# Altium project Autobot_project.PrjPcb
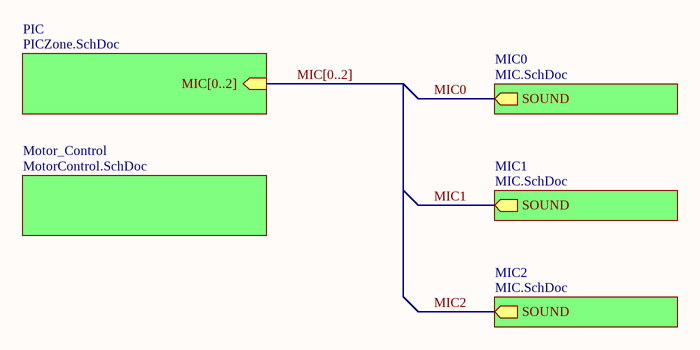
[diagram p0: MicsBus.SchDoc]
3 sheets, 47 parts. Net scope: hierarchical (ports join the sheet entries above them; power ports are global).
Board file: PCB_Autobot.PcbDoc
Sheets:
  MicsBus.SchDoc
    MIC0 = MIC.SchDoc
    MIC1 = MIC.SchDoc
    MIC2 = MIC.SchDoc
    Motor_Control = MotorControl.SchDoc

## Sheet MicsBus.SchDoc: Main
size A4; Organization: Autobot Limited; Address1: 96, boulevard Bessiere; Address4: 75017 PARIS; SheetNumber: 1

### Sub-sheets
MIC0 = MIC.SchDoc: SOUND (out)
MIC1 = MIC.SchDoc: SOUND (out)
MIC2 = MIC.SchDoc: SOUND (out)
Motor_Control = MotorControl.SchDoc: no entries
PIC = PICZone.SchDoc (file not in this document): MIC[0..2] (in)

### Buses and harness runs
bus MIC[0..2] = sheet PIC/MIC[0..2]

### Notes on the sheet
- Title
- Size:
- Date:
- A4
- Number:
- Time:
- Revision:
- Sheet
- of
- File:

## Sheet MIC.SchDoc: Mic
size A4; Organization: Autobot Limited; Address1: 96, boulevard Bessiere; Address4: 75017 PARIS; SheetNumber: 4
Used 3 times, as channels MIC0, MIC1, MIC2. Parts and nets are listed once, with the designators drawn on the sheet.
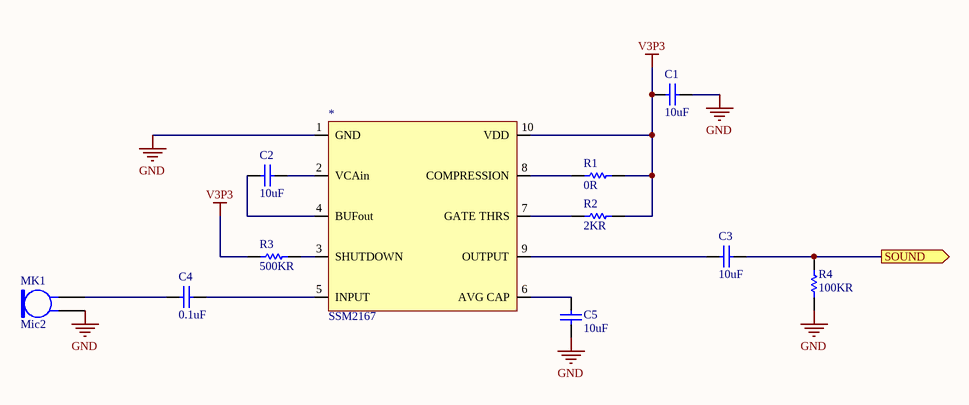
[diagram p1: MIC.SchDoc]

### Parts
*  SSM2167
C1  10uF  [RAD-0.3]
C2  10uF  [RAD-0.3]
C3  10uF  [RAD-0.3]
C4  0.1uF  [RAD-0.3]
C5  10uF  [RAD-0.3]
MK1  Mic2  [PIN2]
R1  0R  [AXIAL-0.3]
R2  2KR  [AXIAL-0.3]
R3  500KR  [AXIAL-0.3]
R4  100KR  [AXIAL-0.3]

### Ports
SOUND (out)

### Nets
GND: *.1(GND) C1.1 C5.2 MK1.1 R4.1
V3P3: *.10(VDD) C1.2 R1.1 R2.1 R3.2
SOUND: C3.1 R4.2 ; port SOUND
Net*_2: *.2(VCAin) C2.1
Net*_3: *.3(SHUTDOWN) R3.1
Net*_4: *.4(BUFout) C2.2
Net*_5: *.5(INPUT) C4.2
Net*_6: *.6(AVG_CAP) C5.1
Net*_7: *.7(GATE_THRS) R2.2
Net*_8: *.8(COMPRESSION) R1.2
Net*_9: *.9(OUTPUT) C3.2
NetC4_1: C4.1 MK1.2

### Channels
MIC0: designators end in _MIC0; ports SOUND=MIC0
MIC1: designators end in _MIC1; ports SOUND=MIC1
MIC2: designators end in _MIC2; ports SOUND=MIC2

### Notes on the sheet
- Title
- Size:
- Date:
- A4
- Number:
- Time:
- Revision:
- Sheet
- of
- File:

### Library data of the parts
* = SSM2167: Fabricant: ANALOG DEVICES; Fournisseur: Farnell; RefFabricant: SSM2167-1RMZ; RefFournisseur: 2067797
C1-C5 = Cap: Capacitor; Published: 8-Jun-2000; LatestRevisionDate: 17-Jul-2002; LatestRevisionNote: Re-released for DXP Platform.; PackageReference: RAD-0.3; Publisher: Altium Limited; PackageDescription: Radial Cap, Thru-Hole; 2 Leads; 0.3 in Pin Spacing
  C1-C3 C5: Value: 10uF
  C4: Value: 0.1uF
MK1 = Mic2: Microphone; Fabricant: PRO SIGNAL; Fournisseur: Farnell; RefFabricant: ABM-708-RC; RefFournisseur: 1736564; Published: 24-Mar-1999; LatestRevisionDate: 17-Jul-2002; LatestRevisionNote: Re-released for DXP Platform.; PackageReference: PIN2; Publisher: Altium Limited
R1-R4 = Res1: Resistor; Published: 8-Jun-2000; LatestRevisionDate: 17-Jul-2002; LatestRevisionNote: Re-released for DXP Platform.; PackageReference: AXIAL-0.3; Publisher: Altium Limited; PackageDescription: Axial Device, Thru-Hole; 2 Leads; 0.3 in Pin Spacing
  R1: Value: 0R
  R2: Value: 2KR
  R3: Value: 500KR
  R4: Value: 100KR

## Sheet MotorControl.SchDoc: Motor Control
size A4; Organization: Autobot Limited; Address1: 96, boulevard Bessiere; Address4: 75017 PARIS; SheetNumber: 2
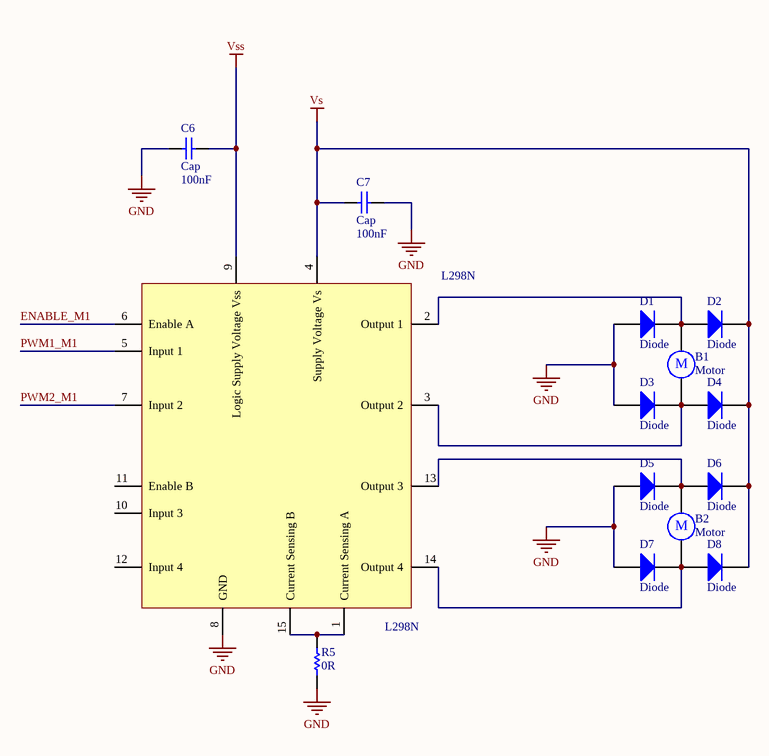
[diagram p2: MotorControl.SchDoc]

### Parts
B1  Motor  [RB5-10.5]
B2  Motor  [RB5-10.5]
C6  Cap  value 100nF  [RAD-0.3]
C7  Cap  value 100nF  [RAD-0.3]
D1  Diode  [SMC]
D2  Diode  [SMC]
D3  Diode  [SMC]
D4  Diode  [SMC]
D5  Diode  [SMC]
D6  Diode  [SMC]
D7  Diode  [SMC]
D8  Diode  [SMC]
L298N  L298N  [L298N]
R5  0R  [AXIAL-0.3]

### Nets
GND: C6.2 C7.2 D1.1(A) D3.1(A) D5.1(A) D7.1(A) L298N.8(GND) R5.1
Vs: C7.1 D2.2(K) D4.2(K) D6.2(K) D8.2(K) L298N.4(Supply_Voltage_Vs)
Vss: C6.1 L298N.9(Logic_Supply_Voltage_Vss)
ENABLE_M1: L298N.6(Enable_A)
PWM1_M1: L298N.5(Input_1)
PWM2_M1: L298N.7(Input_2)
NetB1_1: B1.1 D1.2(K) D2.1(A) L298N.2(Output_1)
NetB1_2: B1.2 D3.2(K) D4.1(A) L298N.3(Output_2)
NetB2_1: B2.1 D5.2(K) D6.1(A) L298N.13(Output_3)
NetB2_2: B2.2 D7.2(K) D8.1(A) L298N.14(Output_4)
NetL298N_1: L298N.1(Current_Sensing_A) L298N.15(Current_Sensing_B) R5.2

Not connected (* = marked no-connect by the designer): L298N 10(Input_3) 11(Enable_B) 12(Input_4)

### Notes on the sheet
- Title
- Size:
- Date:
- A4
- Number:
- Time:
- Revision:
- Sheet
- of
- File:
- (in symbol Motor) M

### Library data of the parts
B1 B2 = Motor: Motor, General Kind; Fournisseur: Olimex; Published: 24-Mar-1999; LatestRevisionDate: 17-Jul-2002; LatestRevisionNote: Re-released for DXP Platform.; PackageReference: RB5-10.5; Publisher: Altium Limited; PackageDescription: Capacitor (Radial); 2 Leads
C6 C7 = Cap: Capacitor; Published: 8-Jun-2000; LatestRevisionDate: 17-Jul-2002; LatestRevisionNote: Re-released for DXP Platform.; PackageReference: RAD-0.3; Publisher: Altium Limited; PackageDescription: Radial Cap, Thru-Hole; 2 Leads; 0.3 in Pin Spacing
D1-D8 = Diode: Default Diode; Fabricant: DIODES INC.; Fournisseur: Farnell; RefFabricant: MURS140-13-F; RefFournisseur: 1858656; Published: 8-Jun-2000; LatestRevisionDate: 17-Jul-2002; LatestRevisionNote: Re-released for DXP Platform.; PackageVersion: Sep-1996; PackageReference: SMC; Publisher: Altium Limited; PackageDescription: DO-214-AB/SMC; 2 C-Bend Leads; Body 7.9 x 5.9 mm, inc. leads (LxW); Code_JEDEC: DO-214-AB
L298N = L298N: Fabricant: STMICROELECTRONICS; Fournisseur: Farnell; RefFournisseur: 403295; RefFabricant: L298N
R5 = Res1: Resistor; Published: 8-Jun-2000; LatestRevisionDate: 17-Jul-2002; LatestRevisionNote: Re-released for DXP Platform.; PackageReference: AXIAL-0.3; Publisher: Altium Limited; PackageDescription: Axial Device, Thru-Hole; 2 Leads; 0.3 in Pin Spacing; Value: 0R

## Nets that join several sheets
GND: MIC0 (5 pins), MIC1 (5 pins), MIC2 (5 pins), MotorControl (8 pins)
V3P3: MIC0 (5 pins), MIC1 (5 pins), MIC2 (5 pins)